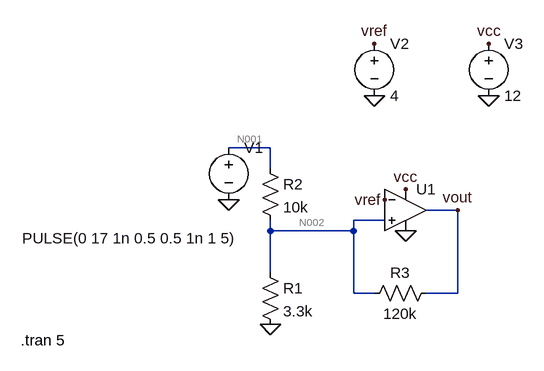
[diagram p0: schematic lab1task3.asc]
lab1task3.asc, the LTspice schematic file:
Version 4
SHEET 1 880 680
WIRE 0 96 -64 96
WIRE 0 128 0 96
WIRE 288 192 240 192
WIRE 176 208 128 208
WIRE 0 224 0 208
WIRE 128 224 128 208
WIRE 128 224 0 224
WIRE 0 288 0 224
WIRE 128 320 128 224
WIRE 160 320 128 320
WIRE 288 320 288 192
WIRE 288 320 240 320
FLAG 208 224 0
FLAG 0 368 0
FLAG -64 176 0
FLAG 160 16 0
FLAG 160 -64 vref
FLAG 176 176 vref
FLAG 336 16 0
FLAG 336 -64 vcc
FLAG 208 160 vcc
FLAG 288 192 vout
SYMBOL OpAmps\\UniversalOpAmp2 208 192 R0
SYMATTR InstName U1
SYMBOL voltage -64 80 R0
WINDOW 3 -318 155 Left 2
WINDOW 123 0 0 Left 0
WINDOW 39 0 0 Left 0
SYMATTR InstName V1
SYMATTR Value PULSE(0 17 1n 0.5 0.5 1n 1 5)
SYMBOL res -16 272 R0
SYMATTR InstName R1
SYMATTR Value 3.3k
SYMBOL res -16 112 R0
SYMATTR InstName R2
SYMATTR Value 10k
SYMBOL res 256 304 R90
WINDOW 0 0 56 VBottom 2
WINDOW 3 32 56 VTop 2
SYMATTR InstName R3
SYMATTR Value 120k
SYMBOL voltage 160 -80 R0
WINDOW 123 0 0 Left 0
WINDOW 39 0 0 Left 0
SYMATTR InstName V2
SYMATTR Value 4
SYMBOL voltage 336 -80 R0
WINDOW 123 0 0 Left 0
WINDOW 39 0 0 Left 0
SYMATTR InstName V3
SYMATTR Value 12
TEXT -384 392 Left 2 !.tran 5

The netlist it stands for:
* lab1task3.asc
XU1 N002 vref vcc 0 vout level2 Avol=1Meg GBW=10Meg Slew=10Meg Ilimit=25m Rail=0 Vos=0 En=0 Enk=0 In=0 Ink=0 Rin=500Meg  ; pins In+ In- V+ V- OUT
V1 N001 0 PULSE(0 17 1n 0.5 0.5 1n 1 5)
R1 N002 0 3.3k
R2 N001 N002 10k
R3 vout N002 120k
V2 vref 0 4
V3 vcc 0 12
.tran 5
.lib UniversalOpAmp2.lib
.backanno
.end

* Results of the author's LTspice run, read from the files saved beside the schematic
* Operating Point, zero values left out:
*   V(vout) = 12.87 µV
*   V(vcc) = 12 V
*   V(vref) = 4 V
*   V(n002) = 29.43 µV
*   I(R1) = 8.919 nA
*   I(R2) = -2.943 nA
*   I(R3) = -138 pA
*   I(V1) = 2.943 nA
*   I(V2) = 4 nA
*   I(V3) = -1.386 µA
*   Ix(u1:1) = -12 nA
*   Ix(u1:2) = -4 nA
*   Ix(u1:3) = 1.386 µA
*   Ix(u1:4) = -1.184 µA
*   Ix(u1:5) = 138 pA
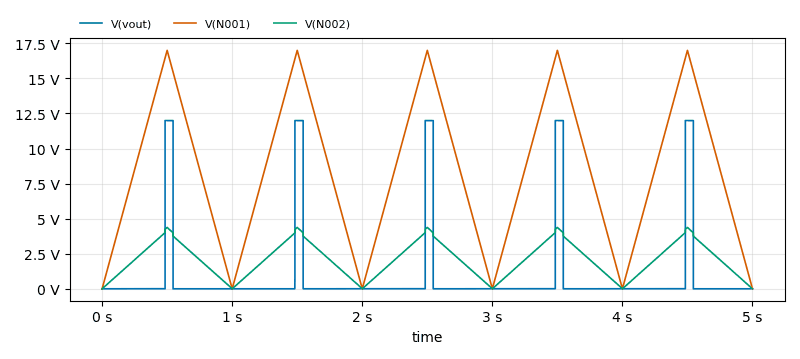
[diagram p1: Transient Analysis of lab1task3.asc, plotted from the saved traces]
* Transient Analysis, 1 run:
*   V(vout): min 12.87 µV, max 12 V, average 741.6 mV, rms 2.982 V, last 13.85 µV
*   V(N001): min 0 V, max 17 V, average 8.5 V, rms 11.58 V, last 0 V
*   V(N002): min 29.43 µV, max 4.376 V, average 2.081 V, rms 2.838 V, last 29.83 µV